# Altium schematic sheet schéma.SchDoc
size A4; SheetNumber: 1; SheetTotal: 1
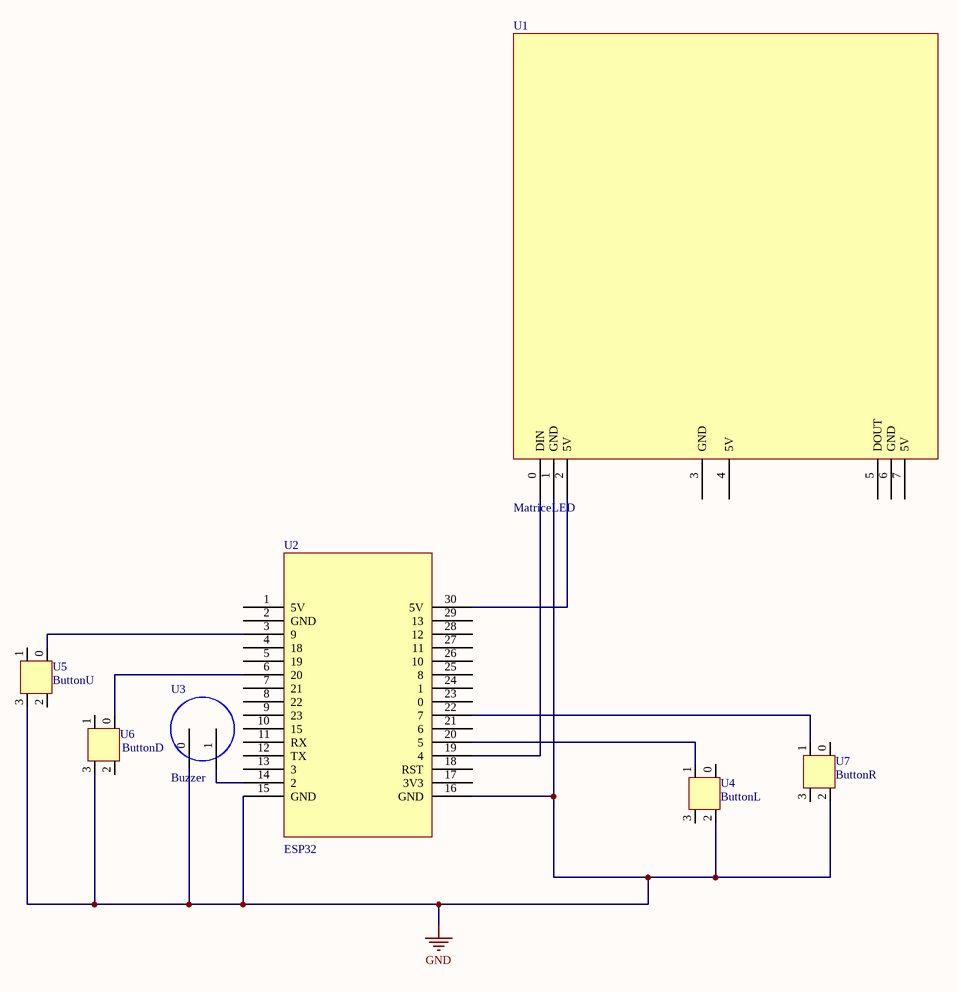
[diagram p0: schéma.SchDoc]

## Parts
U1  MatriceLED  [MATRICEled]
U2  ESP32  [ESP32]
U3  Buzzer  [BUZZER]
U4  ButtonL  [BOUTON]
U5  ButtonU  [BOUTON]
U6  ButtonD  [BOUTON]
U7  ButtonR  [BOUTON]

## Nets
GND: U1.1(GND) U2.15(GND) U2.16(GND) U3.0 U4.2 U5.3 U6.3 U7.2
NetU1_0: U1.0(DIN) U2.19(4)
NetU1_2: U1.2(5V) U2.30(5V)
NetU2_3: U2.3(9) U5.0
NetU2_6: U2.6(20) U6.0
NetU2_14: U2.14(2) U3.1
NetU2_20: U2.20(5) U4.1
NetU2_22: U2.22(7) U7.1

Not connected (* = marked no-connect by the designer): U1 3(GND) 4(5V) 5(DOUT) 6(GND) 7(5V); U2 1(5V) 2(GND) 4(18) 5(19) 7(21) 8(22) 9(23) 10(15) 11(RX) 12(TX) 13(3) 17(3V3) 18(RST) 21(6) 23(0) 24(1) 25(8) 26(10) 27(11) 28(12) 29(13); U4 0(31) 3(31); U5 1(31) 2(31); U6 1(31) 2(31); U7 0(31) 3(31)

## Library data of the parts
U2 = ESP32C6
U4-U7 = Button